# Altium schematic sheet poker_shematics_3.SchDoc
size A4
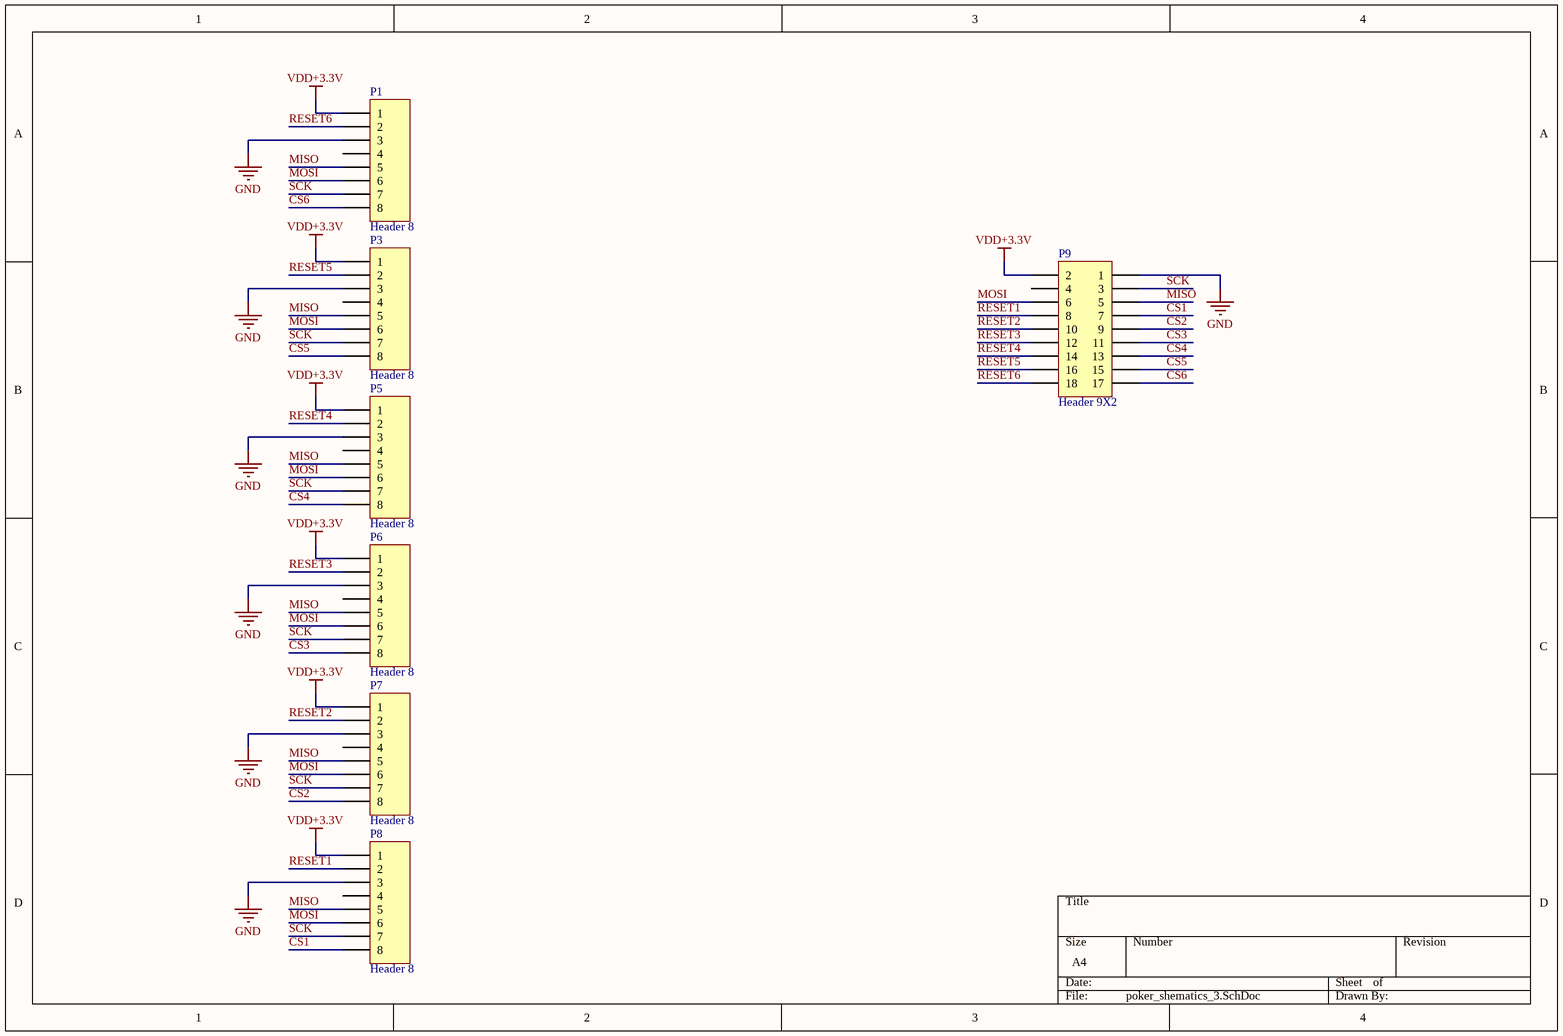
[diagram p0: poker_shematics_3.SchDoc]

## Parts
P1  Header 8  [HDR1X8]
P3  Header 8  [HDR1X8]
P5  Header 8  [HDR1X8]
P6  Header 8  [HDR1X8]
P7  Header 8  [HDR1X8]
P8  Header 8  [HDR1X8]
P9  Header 9X2  [HDR2X9]

## Nets
GND: P1.3 P3.3 P5.3 P6.3 P7.3 P8.3 P9.1
VDD+3.3V: P1.1 P3.1 P5.1 P6.1 P7.1 P8.1 P9.2
CS1: P8.8 P9.7
CS2: P7.8 P9.9
CS3: P6.8 P9.11
CS4: P5.8 P9.13
CS5: P3.8 P9.15
CS6: P1.8 P9.17
MISO: P1.5 P3.5 P5.5 P6.5 P7.5 P8.5 P9.5
MOSI: P1.6 P3.6 P5.6 P6.6 P7.6 P8.6 P9.6
RESET1: P8.2 P9.8
RESET2: P7.2 P9.10
RESET3: P6.2 P9.12
RESET4: P5.2 P9.14
RESET5: P3.2 P9.16
RESET6: P1.2 P9.18
SCK: P1.7 P3.7 P5.7 P6.7 P7.7 P8.7 P9.3

Not connected (* = marked no-connect by the designer): P1 4; P3 4; P5 4; P6 4; P7 4; P8 4; P9 4

## Library data of the parts
P1 P3 P5-P8 = Header 8: Header, 8-Pin; LatestRevisionDate: 17-Jul-2002; LatestRevisionNote: Re-released for DXP Platform.; Publisher: Altium Limited
P9 = Header 9X2: Header, 9-Pin, Dual row; LatestRevisionDate: 17-Jul-2002; LatestRevisionNote: Re-released for DXP Platform.; Publisher: Altium Limited